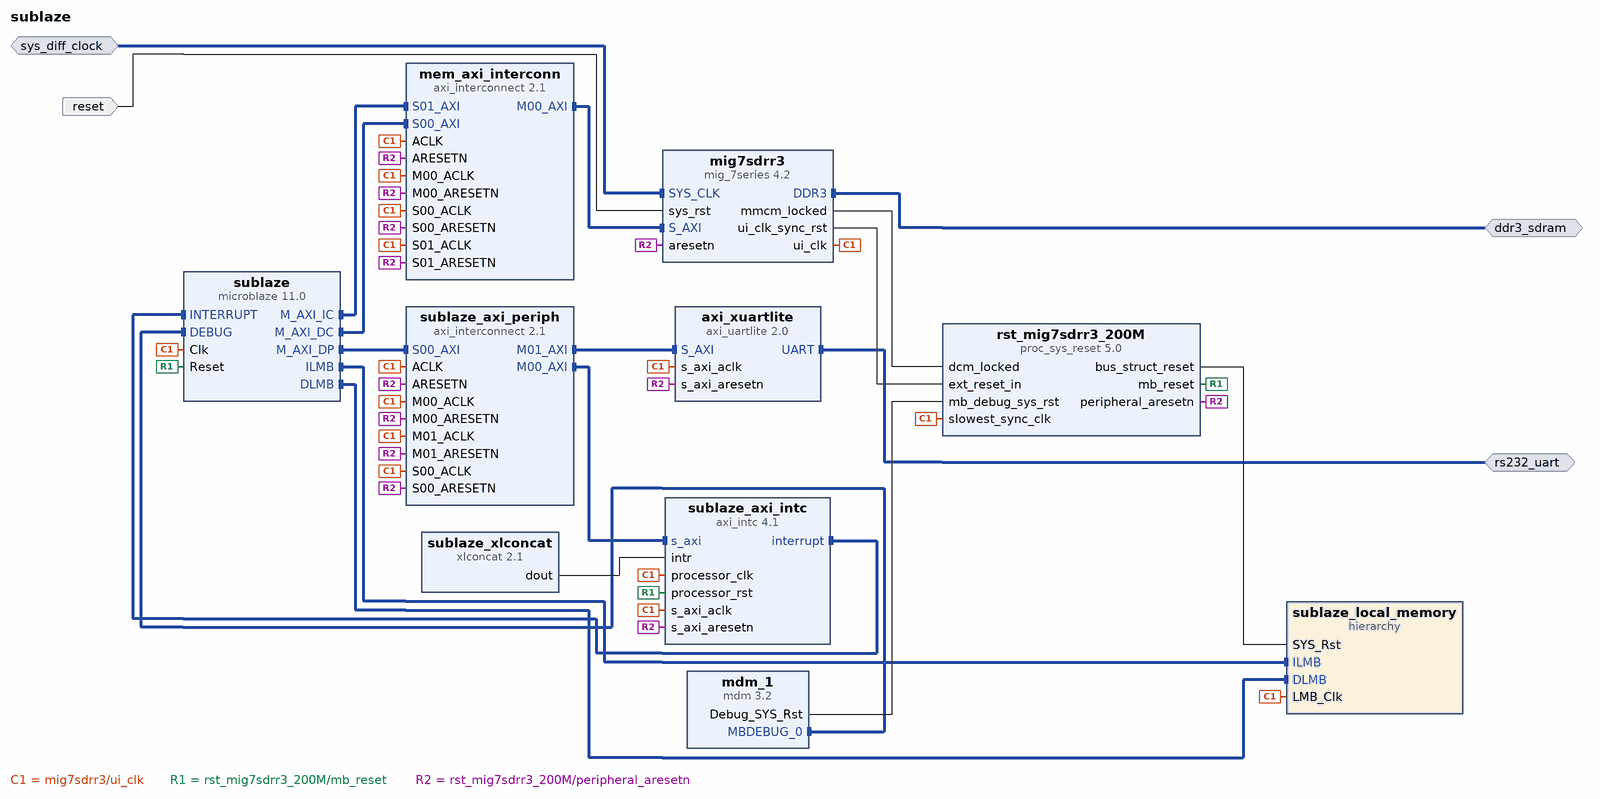
[diagram p0: block diagram of the top level]
# Vivado block design sublaze, xc7vx485tffg1761-2, Vivado 2019.2
create_bd_design sublaze

create_bd_intf_port -mode Master -vlnv xilinx.com:interface:ddrx_rtl:1.0 ddr3_sdram
create_bd_intf_port -mode Slave -vlnv xilinx.com:interface:diff_clock_rtl:1.0 sys_diff_clock
set_property -dict {CONFIG.FREQ_HZ 100000000} [get_bd_intf_ports sys_diff_clock]
create_bd_intf_port -mode Master -vlnv xilinx.com:interface:uart_rtl:1.0 rs232_uart
create_bd_port -dir I -type rst reset
set_property -dict {CONFIG.POLARITY ACTIVE_HIGH} [get_bd_ports reset]

create_bd_cell -type ip -vlnv xilinx.com:ip:mig_7series:4.2 mig7sdrr3
set_property -dict {CONFIG.BOARD_MIG_PARAM ddr3_sdram CONFIG.RESET_BOARD_INTERFACE reset} [get_bd_cells mig7sdrr3]
create_bd_cell -type ip -vlnv xilinx.com:ip:microblaze:11.0 sublaze
set_property -dict [list \
  CONFIG.C_CACHE_BYTE_SIZE 8192 \
  CONFIG.C_DCACHE_BYTE_SIZE 8192 \
  CONFIG.C_DEBUG_ENABLED 1 \
  CONFIG.C_D_AXI 1 \
  CONFIG.C_D_LMB 1 \
  CONFIG.C_I_LMB 1 \
  CONFIG.C_USE_DCACHE 1 \
  CONFIG.C_USE_ICACHE 1 \
] [get_bd_cells sublaze]
create_bd_cell -type hier sublaze_local_memory
create_bd_cell -type ip -vlnv xilinx.com:ip:axi_interconnect:2.1 sublaze_axi_periph
set_property -dict {CONFIG.NUM_MI 2} [get_bd_cells sublaze_axi_periph]
create_bd_cell -type ip -vlnv xilinx.com:ip:axi_intc:4.1 sublaze_axi_intc
set_property -dict {CONFIG.C_HAS_FAST 1} [get_bd_cells sublaze_axi_intc]
create_bd_cell -type ip -vlnv xilinx.com:ip:xlconcat:2.1 sublaze_xlconcat
create_bd_cell -type ip -vlnv xilinx.com:ip:mdm:3.2 mdm_1
create_bd_cell -type ip -vlnv xilinx.com:ip:proc_sys_reset:5.0 rst_mig7sdrr3_200M
create_bd_cell -type ip -vlnv xilinx.com:ip:axi_interconnect:2.1 mem_axi_interconn
set_property -dict {CONFIG.NUM_MI 1 CONFIG.NUM_SI 2} [get_bd_cells mem_axi_interconn]
create_bd_cell -type ip -vlnv xilinx.com:ip:axi_uartlite:2.0 axi_xuartlite
set_property -dict {CONFIG.UARTLITE_BOARD_INTERFACE rs232_uart CONFIG.USE_BOARD_FLOW true} [get_bd_cells axi_xuartlite]

# ---- hierarchy /sublaze_local_memory ----
current_bd_instance /sublaze_local_memory
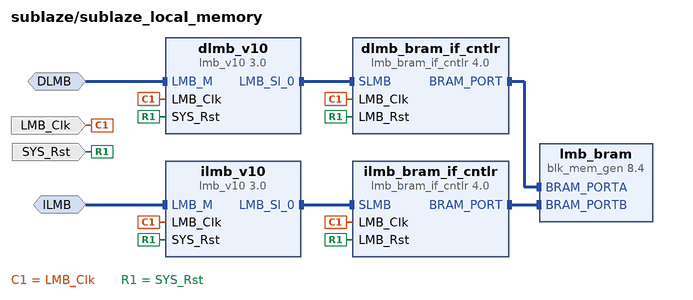
[diagram p1: block diagram inside /sublaze_local_memory]
create_bd_intf_pin -mode MirroredMaster -vlnv xilinx.com:interface:lmb_rtl:1.0 DLMB
create_bd_intf_pin -mode MirroredMaster -vlnv xilinx.com:interface:lmb_rtl:1.0 ILMB
create_bd_pin -dir I -type clk LMB_Clk
create_bd_pin -dir I -type rst SYS_Rst

create_bd_cell -type ip -vlnv xilinx.com:ip:lmb_v10:3.0 dlmb_v10
create_bd_cell -type ip -vlnv xilinx.com:ip:lmb_v10:3.0 ilmb_v10
create_bd_cell -type ip -vlnv xilinx.com:ip:lmb_bram_if_cntlr:4.0 dlmb_bram_if_cntlr
set_property -dict {CONFIG.C_ECC 0} [get_bd_cells dlmb_bram_if_cntlr]
create_bd_cell -type ip -vlnv xilinx.com:ip:lmb_bram_if_cntlr:4.0 ilmb_bram_if_cntlr
set_property -dict {CONFIG.C_ECC 0} [get_bd_cells ilmb_bram_if_cntlr]
create_bd_cell -type ip -vlnv xilinx.com:ip:blk_mem_gen:8.4 lmb_bram
set_property -dict {CONFIG.Memory_Type True_Dual_Port_RAM CONFIG.use_bram_block BRAM_Controller} [get_bd_cells lmb_bram]

# ---- connections ----

current_bd_instance /sublaze_local_memory
connect_bd_intf_net -intf_net sublaze_ilmb [get_bd_intf_pins ILMB] [get_bd_intf_pins ilmb_v10/LMB_M]
connect_bd_intf_net -intf_net sublaze_ilmb_cntlr [get_bd_intf_pins ilmb_bram_if_cntlr/BRAM_PORT] [get_bd_intf_pins lmb_bram/BRAM_PORTB]
connect_bd_intf_net -intf_net sublaze_dlmb_bus [get_bd_intf_pins dlmb_v10/LMB_Sl_0] [get_bd_intf_pins dlmb_bram_if_cntlr/SLMB]
connect_bd_intf_net -intf_net sublaze_dlmb [get_bd_intf_pins DLMB] [get_bd_intf_pins dlmb_v10/LMB_M]
connect_bd_intf_net -intf_net sublaze_dlmb_cntlr [get_bd_intf_pins dlmb_bram_if_cntlr/BRAM_PORT] [get_bd_intf_pins lmb_bram/BRAM_PORTA]
connect_bd_intf_net -intf_net sublaze_ilmb_bus [get_bd_intf_pins ilmb_v10/LMB_Sl_0] [get_bd_intf_pins ilmb_bram_if_cntlr/SLMB]
connect_bd_net -net sublaze_Clk [get_bd_pins LMB_Clk] \
  [get_bd_pins dlmb_v10/LMB_Clk] [get_bd_pins dlmb_bram_if_cntlr/LMB_Clk] [get_bd_pins ilmb_v10/LMB_Clk] \
  [get_bd_pins ilmb_bram_if_cntlr/LMB_Clk]
connect_bd_net [get_bd_pins SYS_Rst] \
  [get_bd_pins dlmb_v10/SYS_Rst] [get_bd_pins dlmb_bram_if_cntlr/LMB_Rst] [get_bd_pins ilmb_v10/SYS_Rst] \
  [get_bd_pins ilmb_bram_if_cntlr/LMB_Rst]
set_property HDL_ATTRIBUTE.BMM_INFO_ADDRESS_SPACE {byte  0x00000000 32 > sublaze sublaze_local_memory/lmb_bram} [get_bd_cells dlmb_bram_if_cntlr]
set_property HDL_ATTRIBUTE.KEEP_HIERARCHY yes [get_bd_cells dlmb_bram_if_cntlr]

current_bd_instance /
connect_bd_intf_net [get_bd_intf_ports sys_diff_clock] [get_bd_intf_pins mig7sdrr3/SYS_CLK]
connect_bd_intf_net -intf_net mig_7series_0_DDR3 [get_bd_intf_ports ddr3_sdram] [get_bd_intf_pins mig7sdrr3/DDR3]
connect_bd_intf_net -intf_net axi_interconnect_0_M00_AXI [get_bd_intf_pins mem_axi_interconn/M00_AXI] [get_bd_intf_pins mig7sdrr3/S_AXI]
connect_bd_intf_net -intf_net sublaze_axi_dp [get_bd_intf_pins sublaze_axi_periph/S00_AXI] [get_bd_intf_pins sublaze/M_AXI_DP]
connect_bd_intf_net -intf_net sublaze_intc_axi [get_bd_intf_pins sublaze_axi_periph/M00_AXI] [get_bd_intf_pins sublaze_axi_intc/s_axi]
connect_bd_intf_net [get_bd_intf_pins sublaze_axi_intc/interrupt] [get_bd_intf_pins sublaze/INTERRUPT]
connect_bd_intf_net [get_bd_intf_pins sublaze/ILMB] [get_bd_intf_pins sublaze_local_memory/ILMB]
connect_bd_intf_net [get_bd_intf_pins sublaze/DLMB] [get_bd_intf_pins sublaze_local_memory/DLMB]
connect_bd_intf_net [get_bd_intf_pins mdm_1/MBDEBUG_0] [get_bd_intf_pins sublaze/DEBUG]
connect_bd_intf_net [get_bd_intf_pins sublaze/M_AXI_IC] [get_bd_intf_pins mem_axi_interconn/S01_AXI]
connect_bd_intf_net [get_bd_intf_pins sublaze/M_AXI_DC] [get_bd_intf_pins mem_axi_interconn/S00_AXI]
connect_bd_intf_net -intf_net axi_uartlite_0_UART [get_bd_intf_ports rs232_uart] [get_bd_intf_pins axi_xuartlite/UART]
connect_bd_intf_net [get_bd_intf_pins sublaze_axi_periph/M01_AXI] [get_bd_intf_pins axi_xuartlite/S_AXI]
connect_bd_net [get_bd_ports reset] [get_bd_pins mig7sdrr3/sys_rst]
connect_bd_net -net sublaze_intr [get_bd_pins sublaze_xlconcat/dout] [get_bd_pins sublaze_axi_intc/intr]
connect_bd_net -net sublaze_Clk [get_bd_pins mig7sdrr3/ui_clk] \
  [get_bd_pins sublaze/Clk] [get_bd_pins sublaze_axi_periph/ACLK] [get_bd_pins sublaze_axi_periph/S00_ACLK] \
  [get_bd_pins sublaze_axi_periph/M00_ACLK] [get_bd_pins sublaze_axi_intc/s_axi_aclk] \
  [get_bd_pins sublaze_axi_intc/processor_clk] [get_bd_pins sublaze_local_memory/LMB_Clk] \
  [get_bd_pins rst_mig7sdrr3_200M/slowest_sync_clk] [get_bd_pins mem_axi_interconn/S00_ACLK] \
  [get_bd_pins mem_axi_interconn/M00_ACLK] [get_bd_pins mem_axi_interconn/ACLK] [get_bd_pins mem_axi_interconn/S01_ACLK] \
  [get_bd_pins axi_xuartlite/s_axi_aclk] [get_bd_pins sublaze_axi_periph/M01_ACLK]
connect_bd_net [get_bd_pins mig7sdrr3/mmcm_locked] [get_bd_pins rst_mig7sdrr3_200M/dcm_locked]
connect_bd_net [get_bd_pins mig7sdrr3/ui_clk_sync_rst] [get_bd_pins rst_mig7sdrr3_200M/ext_reset_in]
connect_bd_net [get_bd_pins rst_mig7sdrr3_200M/mb_reset] [get_bd_pins sublaze/Reset] [get_bd_pins sublaze_axi_intc/processor_rst]
connect_bd_net [get_bd_pins rst_mig7sdrr3_200M/bus_struct_reset] [get_bd_pins sublaze_local_memory/SYS_Rst]
connect_bd_net [get_bd_pins rst_mig7sdrr3_200M/peripheral_aresetn] \
  [get_bd_pins sublaze_axi_periph/ARESETN] [get_bd_pins sublaze_axi_periph/S00_ARESETN] \
  [get_bd_pins sublaze_axi_periph/M00_ARESETN] [get_bd_pins sublaze_axi_intc/s_axi_aresetn] \
  [get_bd_pins mem_axi_interconn/S00_ARESETN] [get_bd_pins mig7sdrr3/aresetn] [get_bd_pins mem_axi_interconn/M00_ARESETN] \
  [get_bd_pins mem_axi_interconn/ARESETN] [get_bd_pins mem_axi_interconn/S01_ARESETN] \
  [get_bd_pins axi_xuartlite/s_axi_aresetn] [get_bd_pins sublaze_axi_periph/M01_ARESETN]
connect_bd_net [get_bd_pins mdm_1/Debug_SYS_Rst] [get_bd_pins rst_mig7sdrr3_200M/mb_debug_sys_rst]
set_property HDL_ATTRIBUTE.BMM_INFO_PROCESSOR {microblaze-le > sublaze sublaze_local_memory/dlmb_bram_if_cntlr} [get_bd_cells sublaze]
set_property HDL_ATTRIBUTE.KEEP_HIERARCHY yes [get_bd_cells sublaze]

# ---- address map ----
assign_bd_address -offset 0x00000000 -range 8K -target_address_space [get_bd_addr_spaces sublaze/Data] [get_bd_addr_segs sublaze_local_memory/dlmb_bram_if_cntlr/SLMB/Mem]
assign_bd_address -offset 0x40600000 -range 64K -target_address_space [get_bd_addr_spaces sublaze/Data] [get_bd_addr_segs axi_xuartlite/S_AXI/Reg]
assign_bd_address -offset 0x41200000 -range 64K -target_address_space [get_bd_addr_spaces sublaze/Data] [get_bd_addr_segs sublaze_axi_intc/S_AXI/Reg]
assign_bd_address -offset 0x80000000 -range 1G -target_address_space [get_bd_addr_spaces sublaze/Data] [get_bd_addr_segs mig7sdrr3/memmap/memaddr]
assign_bd_address -offset 0x00000000 -range 8K -target_address_space [get_bd_addr_spaces sublaze/Instruction] [get_bd_addr_segs sublaze_local_memory/ilmb_bram_if_cntlr/SLMB/Mem]
assign_bd_address -offset 0x80000000 -range 1G -target_address_space [get_bd_addr_spaces sublaze/Instruction] [get_bd_addr_segs mig7sdrr3/memmap/memaddr]

validate_bd_design
save_bd_design
